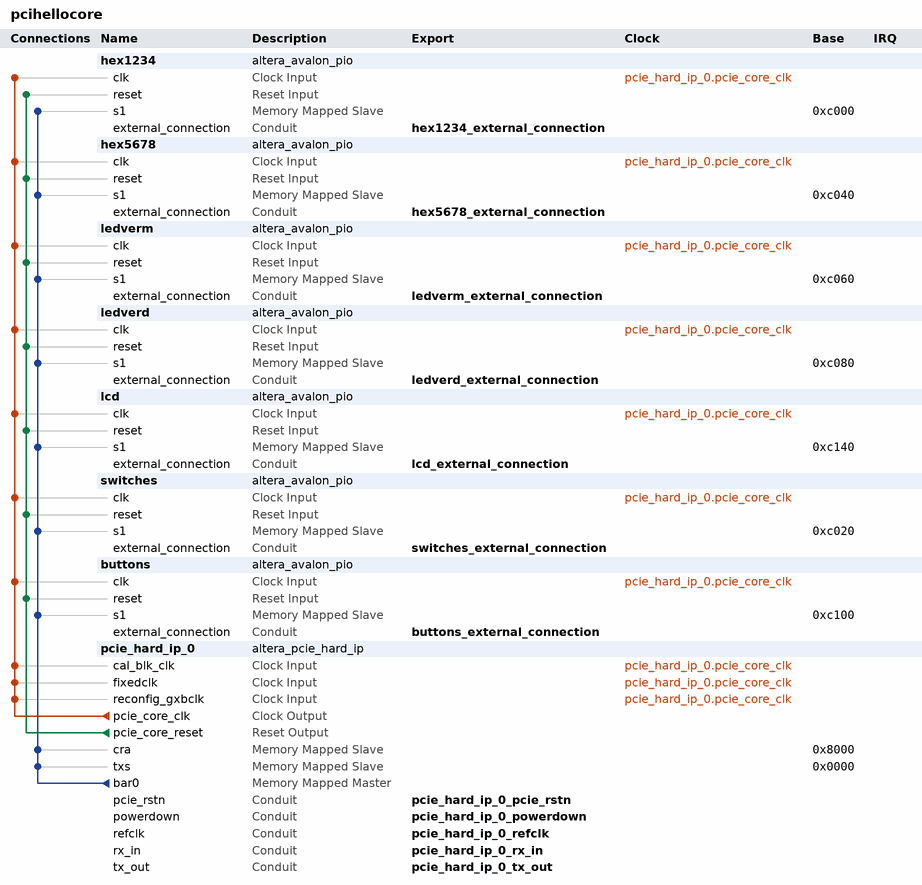
[diagram p0: system contents]
# Platform Designer (Qsys) system pcihellocore, Cyclone IV GX EP4CGX150DF31C7
# Parameters at their usual value, and those the tool derives, are not listed.
package require -exact qsys 15.0
create_system pcihellocore
set_project_property DEVICE_FAMILY {Cyclone IV GX}
set_project_property DEVICE EP4CGX150DF31C7

add_instance hex1234 altera_avalon_pio 15.0
set_instance_parameter_value hex1234 direction Output
set_instance_parameter_value hex1234 resetValue 1077952576
set_instance_parameter_value hex1234 width 32

add_instance hex5678 altera_avalon_pio 15.0
set_instance_parameter_value hex5678 direction Output
set_instance_parameter_value hex5678 resetValue 1077952576
set_instance_parameter_value hex5678 width 32

add_instance ledverm altera_avalon_pio 15.0
set_instance_parameter_value ledverm direction Output
set_instance_parameter_value ledverm width 32

add_instance ledverd altera_avalon_pio 15.0
set_instance_parameter_value ledverd direction Output
set_instance_parameter_value ledverd width 32

add_instance lcd altera_avalon_pio 15.0
set_instance_parameter_value lcd direction Output
set_instance_parameter_value lcd width 32

add_instance switches altera_avalon_pio 15.0
set_instance_parameter_value switches direction Input
set_instance_parameter_value switches width 32

add_instance buttons altera_avalon_pio 15.0
set_instance_parameter_value buttons direction Input
set_instance_parameter_value buttons width 32

add_instance pcie_hard_ip_0 altera_pcie_hard_ip 15.0
set_instance_parameter_value pcie_hard_ip_0 {BAR Type} {32 bit Non-Prefetchable,Not used,Not used,Not used,Not used,Not used}
set_instance_parameter_value pcie_hard_ip_0 CB_A2P_ADDR_MAP_PASS_THRU_BITS 15
set_instance_parameter_value pcie_hard_ip_0 CG_ENABLE_A2P_INTERRUPT 0
set_instance_parameter_value pcie_hard_ip_0 CG_NO_CPL_REORDERING 0
set_instance_parameter_value pcie_hard_ip_0 {PCIe Address 31:0} 0x00000000,0x00000000,0x00000000,0x00000000,0x00000000,0x00000000,0x00000000,0x00000000,0x00000000,0x00000000,0x00000000,0x00000000,0x00000000,0x00000000,0x00000000,0x00000000
set_instance_parameter_value pcie_hard_ip_0 {PCIe Address 63:32} 0x00000000,0x00000000,0x00000000,0x00000000,0x00000000,0x00000000,0x00000000,0x00000000,0x00000000,0x00000000,0x00000000,0x00000000,0x00000000,0x00000000,0x00000000,0x00000000
set_instance_parameter_value pcie_hard_ip_0 class_code 0
set_instance_parameter_value pcie_hard_ip_0 device_id 4
set_instance_parameter_value pcie_hard_ip_0 my_advanced_errors false
set_instance_parameter_value pcie_hard_ip_0 my_enable_ecrc_check false
set_instance_parameter_value pcie_hard_ip_0 my_enable_ecrc_gen false
set_instance_parameter_value pcie_hard_ip_0 p_pcie_test_out_width None
set_instance_parameter_value pcie_hard_ip_0 p_user_msi_enable 0
set_instance_parameter_value pcie_hard_ip_0 subsystem_device_id 4
set_instance_parameter_value pcie_hard_ip_0 subsystem_vendor_id 4466
set_instance_parameter_value pcie_hard_ip_0 vendor_id 4466

# connections
add_connection pcie_hard_ip_0.pcie_core_clk buttons.clk clock
add_connection pcie_hard_ip_0.pcie_core_clk hex1234.clk clock
add_connection pcie_hard_ip_0.pcie_core_clk hex5678.clk clock
add_connection pcie_hard_ip_0.pcie_core_clk lcd.clk clock
add_connection pcie_hard_ip_0.pcie_core_clk ledverd.clk clock
add_connection pcie_hard_ip_0.pcie_core_clk ledverm.clk clock
add_connection pcie_hard_ip_0.pcie_core_clk pcie_hard_ip_0.cal_blk_clk clock
add_connection pcie_hard_ip_0.pcie_core_clk pcie_hard_ip_0.fixedclk clock
add_connection pcie_hard_ip_0.pcie_core_clk pcie_hard_ip_0.reconfig_gxbclk clock
add_connection pcie_hard_ip_0.pcie_core_clk switches.clk clock
add_connection pcie_hard_ip_0.pcie_core_reset buttons.reset reset
add_connection pcie_hard_ip_0.pcie_core_reset hex1234.reset reset
add_connection pcie_hard_ip_0.pcie_core_reset hex5678.reset reset
add_connection pcie_hard_ip_0.pcie_core_reset lcd.reset reset
add_connection pcie_hard_ip_0.pcie_core_reset ledverd.reset reset
add_connection pcie_hard_ip_0.pcie_core_reset ledverm.reset reset
add_connection pcie_hard_ip_0.pcie_core_reset switches.reset reset
add_connection pcie_hard_ip_0.bar0 buttons.s1 avalon
set_connection_parameter_value pcie_hard_ip_0.bar0/buttons.s1 baseAddress 0xc100
add_connection pcie_hard_ip_0.bar0 hex1234.s1 avalon
set_connection_parameter_value pcie_hard_ip_0.bar0/hex1234.s1 baseAddress 0xc000
add_connection pcie_hard_ip_0.bar0 hex5678.s1 avalon
set_connection_parameter_value pcie_hard_ip_0.bar0/hex5678.s1 baseAddress 0xc040
add_connection pcie_hard_ip_0.bar0 lcd.s1 avalon
set_connection_parameter_value pcie_hard_ip_0.bar0/lcd.s1 baseAddress 0xc140
add_connection pcie_hard_ip_0.bar0 ledverd.s1 avalon
set_connection_parameter_value pcie_hard_ip_0.bar0/ledverd.s1 baseAddress 0xc080
add_connection pcie_hard_ip_0.bar0 ledverm.s1 avalon
set_connection_parameter_value pcie_hard_ip_0.bar0/ledverm.s1 baseAddress 0xc060
add_connection pcie_hard_ip_0.bar0 pcie_hard_ip_0.cra avalon
set_connection_parameter_value pcie_hard_ip_0.bar0/pcie_hard_ip_0.cra baseAddress 0x8000
add_connection pcie_hard_ip_0.bar0 pcie_hard_ip_0.txs avalon
set_connection_parameter_value pcie_hard_ip_0.bar0/pcie_hard_ip_0.txs baseAddress 0x0000
add_connection pcie_hard_ip_0.bar0 switches.s1 avalon
set_connection_parameter_value pcie_hard_ip_0.bar0/switches.s1 baseAddress 0xc020

# exported interfaces
add_interface buttons_external_connection conduit end
set_interface_property buttons_external_connection EXPORT_OF buttons.external_connection
add_interface hex1234_external_connection conduit end
set_interface_property hex1234_external_connection EXPORT_OF hex1234.external_connection
add_interface hex5678_external_connection conduit end
set_interface_property hex5678_external_connection EXPORT_OF hex5678.external_connection
add_interface lcd_external_connection conduit end
set_interface_property lcd_external_connection EXPORT_OF lcd.external_connection
add_interface ledverd_external_connection conduit end
set_interface_property ledverd_external_connection EXPORT_OF ledverd.external_connection
add_interface ledverm_external_connection conduit end
set_interface_property ledverm_external_connection EXPORT_OF ledverm.external_connection
add_interface pcie_hard_ip_0_pcie_rstn conduit end
set_interface_property pcie_hard_ip_0_pcie_rstn EXPORT_OF pcie_hard_ip_0.pcie_rstn
add_interface pcie_hard_ip_0_powerdown conduit end
set_interface_property pcie_hard_ip_0_powerdown EXPORT_OF pcie_hard_ip_0.powerdown
add_interface pcie_hard_ip_0_refclk conduit end
set_interface_property pcie_hard_ip_0_refclk EXPORT_OF pcie_hard_ip_0.refclk
add_interface pcie_hard_ip_0_rx_in conduit end
set_interface_property pcie_hard_ip_0_rx_in EXPORT_OF pcie_hard_ip_0.rx_in
add_interface pcie_hard_ip_0_tx_out conduit end
set_interface_property pcie_hard_ip_0_tx_out EXPORT_OF pcie_hard_ip_0.tx_out
add_interface switches_external_connection conduit end
set_interface_property switches_external_connection EXPORT_OF switches.external_connection

set_interconnect_requirement {$system} qsys_mm.clockCrossingAdapter HANDSHAKE
set_interconnect_requirement {$system} qsys_mm.maxAdditionalLatency 1

save_system pcihellocore.qsys
